# EasyEDA Pro project ProProject_Hi3861_v2.1_2024-07-26.epro, board PCB3
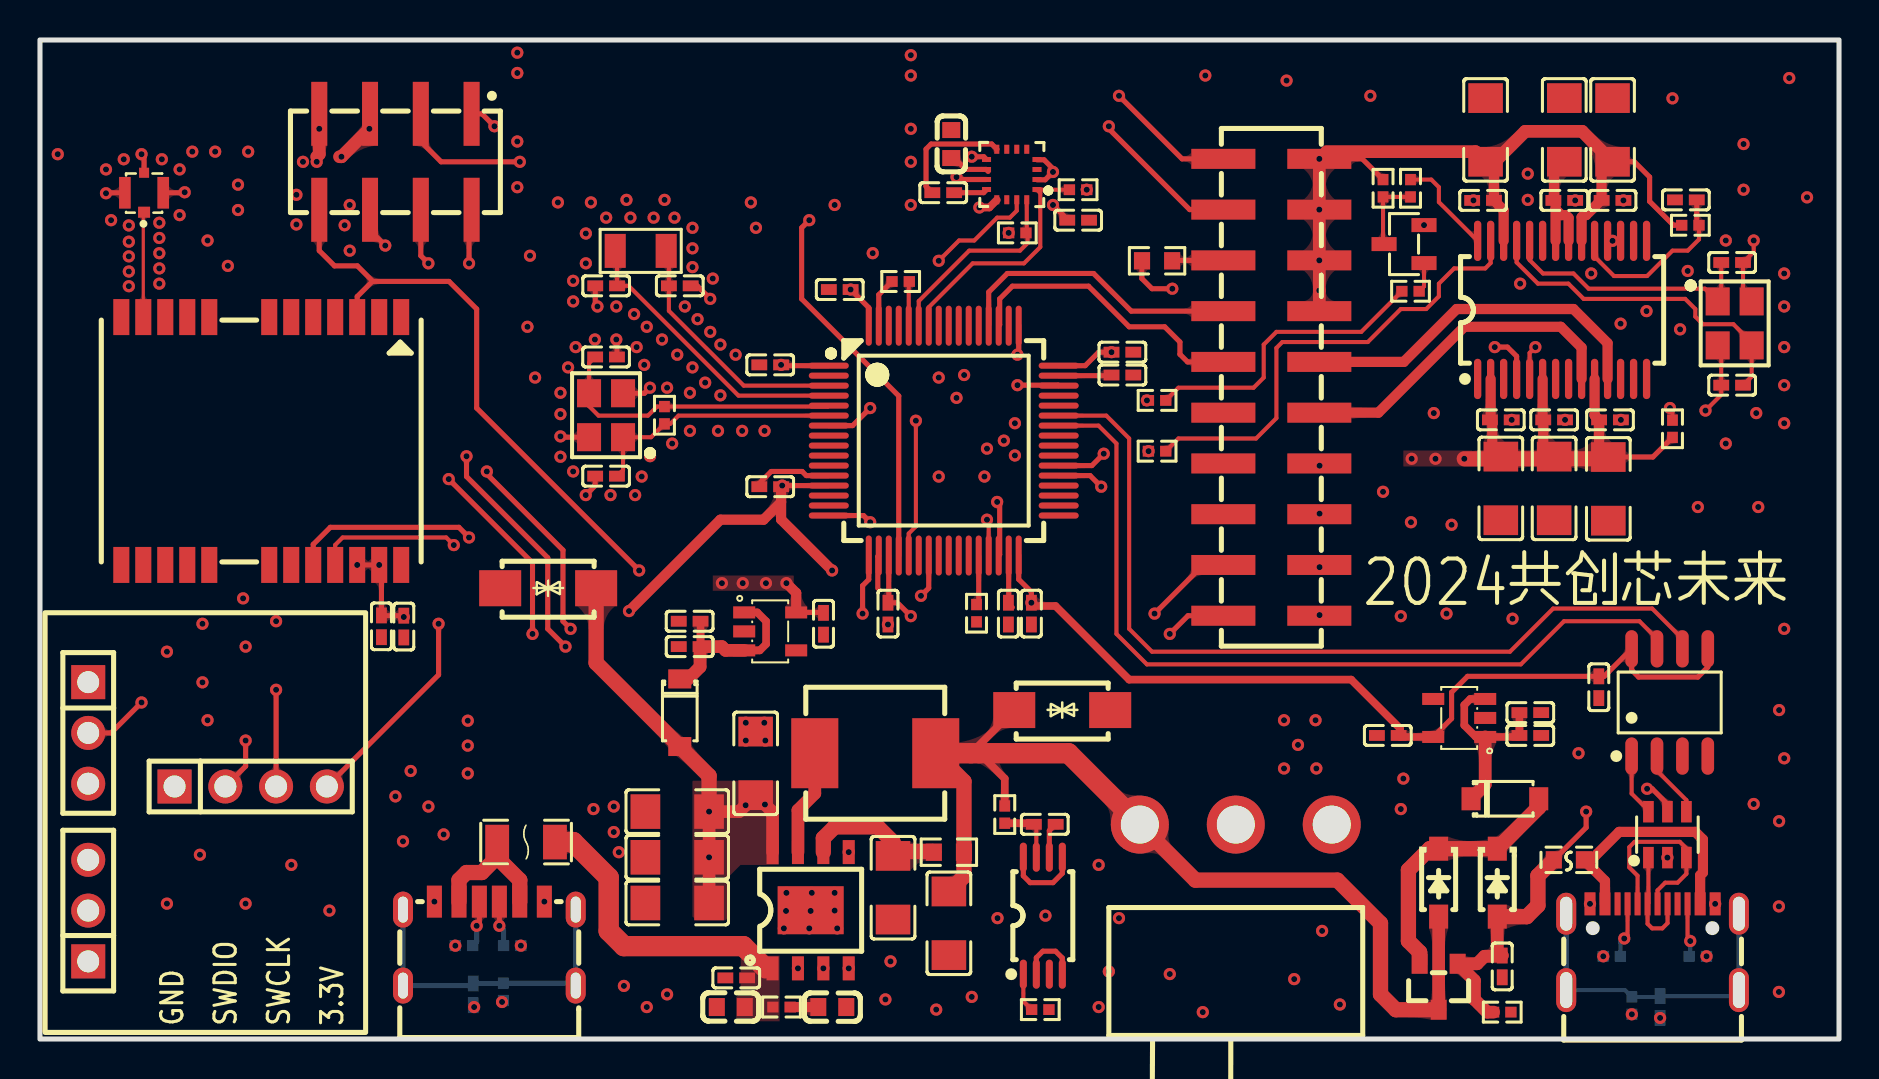
[diagram p8: board, top side]
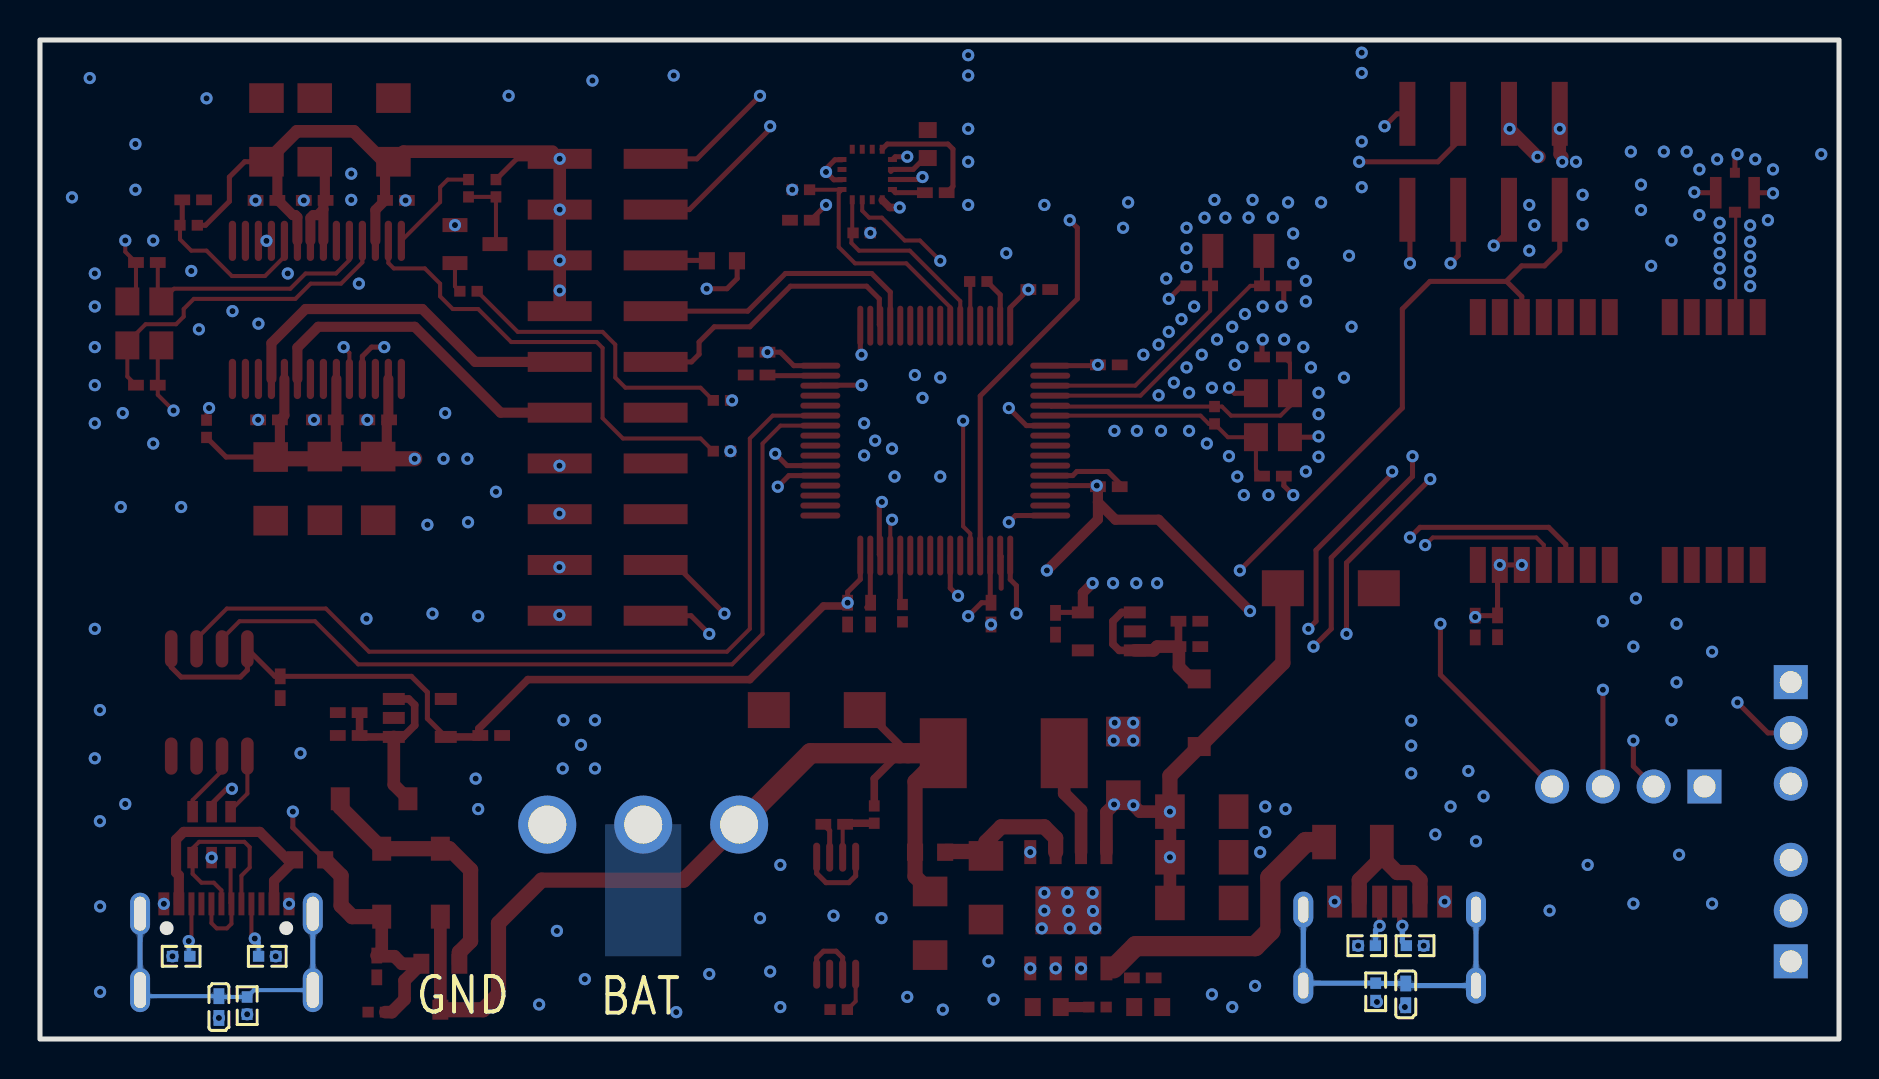
[diagram p9: board, bottom side, seen from below]

Outline 89.99 x 49.99 mm; copper layers: Top Layer, Inner1, Inner2, Bottom Layer. Coordinates in mm from the lower left corner of the outline.
Outline path: rectangle 0,49.99 89.99,0
Stack: Top Layer 0.035mm 外层铜厚1oz / Dielectric1 0.2104mm 7628 RC49% 8.6mil / Inner1 0.0152mm 内层铜厚 / Dielectric2 1.065mm 1.1mm H/HOZ 含铜 / Inner2 0.0152mm 内层铜厚 / Dielectric3 0.2104mm 7628 RC49% 8.6mil / Bottom Layer 0.035mm 外层铜厚1oz

## Design rules (mm)
template: JLCPCB Capability(Two Layers Board)
spacing copperThickness1oz (default): track to track 0.102, other pairs 0.152 to 0.3
spacing copperThickness2oz: track to track 0.203, other pairs 0.152 to 0.3
track width copperThickness1oz (default): min 0.127, default 0.254, max 2.54
track width copperThickness2oz: min 0.203, default 0.254, max 2.54
differential pair differentialPair (default): width min 0.127, default 0.254, max 2.54; gap min 0.152, default 0.152
via viaSize (default): diameter min 0.5, default 0.61, max 10; hole min 0.3, default 0.305, max 6.3

## Placement (name value [footprint] x y rotation side)
C1  100nF  [C0402]  34.83 3.06 0 top
C3  100nF  [C0402]  77.98 17.6 90 top
C5  22uf  [C1206]  42.67 7.57 90 top
C6  22uf  [C1206]  45.47 5.79 90 top
C8  22uf  [C1206]  35.8 13.79 270 top
C9  22uf  [C1206]  31.88 11.38 0 top
C10  22uf  [C1206]  31.88 9.09 0 top
C11  22uf  [C1206]  31.88 6.81 0 top
C12  104p  [C0402]  50.26 10.74 180 top
C13  47nf  [C0402]  73.15 3.63 90 top
C17  10u  [C0402]  74.55 16.33 0 top
C18  100nF  [C0402]  74.55 15.19 0 top
C19  10u  [C0402]  67.42 15.19 180 top
C20  100nF  [C0402]  18.2 20.64 90 top
C21  100nF  [C0402]  17.08 20.65 90 top
C24  10U  [C0603]  39.63 1.6 180 top
C25  10U  [C0603]  34.56 1.6 0 top
C28  100nF  [C0402]  36.53 33.73 0 top
C29  100nF  [C0402]  42.42 21.28 90 top
C32  100nF  [C0402]  49.59 21.28 90 top
C33  100nF  [C0402]  54.15 34.37 180 top
C34  100nF  [C0402]  40 37.5 0 top
C35  100nF  [C0402]  36.53 27.64 0 top
C40  2.2u  [C0402]  54.15 33.22 180 top
C41  2.2u  [C0402]  48.44 21.28 90 top
C42  20p  [C0402]  28.32 28.16 0 top
C43  20p  [C0402]  28.32 34.13 0 top
C44  20p  [C0402]  32 37.69 0 top
C45  20p  [C0402]  28.32 37.69 180 top
C54  100nF  [C0402]  81.04 1.6 90 bottom
C55  10u  [C0402]  32.5 20.9 180 top
C56  100nF  [C0402]  32.5 19.63 180 top
C57  10u  [C0402]  39.19 20.78 270 top
C58  100nF  [C0402]  21.67 2.23 90 bottom
C59  4.7u  [C0603]  45.59 44.78 270 top
C60  220n  [C0402]  45.18 42.35 180 top
C61  100nF  [C0402]  51.93 40.97 180 top
C62  20p  [C0402]  84.65 38.85 180 top
C63  20p  [C0402]  84.65 32.72 180 top
C64  100nF  [C0402]  82.33 41.99 0 top
C65  100nF  [C0402]  76.25 41.96 180 top
C66  100nF  [C0402]  73.07 30.98 180 top
C67  100nF  [C0402]  75.74 30.98 180 top
C68  100nF  [C0402]  78.54 30.98 180 top
C69  100nF  [C0402]  72.19 41.96 0 top
C70  100nF  [C0402]  78.66 41.96 180 top
C71  47uf  [C1206]  76.25 45.49 270 top
C72  47uf  [C1206]  73.07 27.55 90 top
C73  47uf  [C1206]  75.74 27.55 90 top
C74  47uf  [C1206]  78.45 27.53 90 top
C75  47uf  [C1206]  72.31 45.49 270 top
C76  47uf  [C1206]  78.66 45.49 270 top
CN1  PM254-2-10-S-8.5  [HDR-SMD_20P-P2.54-V-F-R2-C10-S2.54-LS7.1]  61.59 32.61 90 top
CN2  PM254-2-04-S-8.5  [HDR-SMD_8P-P2.54-V-F-R2-C4-S7.1]  17.78 43.89 180 top
CRYSTAL1  16MHz  [CRYSTAL-SMD_4P-L3.2-W2.5-BL_SIT8008BI]  28.32 31.21 90 top
CRYSTAL2  16MHz  [CRYSTAL-SMD_4P-L3.2-W2.5-BL_SIT8008BI]  84.77 35.81 270 top
D1  SMAJ15CA  [SMA_L4.3-W2.7-LS5.1-BI]  51.13 16.46 180 top
D2  SMAJ15CA  [SMA_L4.3-W2.7-LS5.1-BI]  25.42 22.56 180 top
D4  DSS24  [SOD-123_L2.8-W1.8-LS3.7-RD]  73.28 12.02 0 top
D5  USBLC6-2SC6  [SOT-23-6_L2.9-W1.6-P0.95-LS2.8-BL]  81.41 10.23 0 top
D6  DSS24  [SOD-123_L2.8-W1.8-LS3.7-RD]  32 16.33 270 top
D7  1N5819HW  [SOD-123_L2.7-W1.6-LS3.7-RD-1]  72.9 7.82 270 top
D8  1N5819HW  [SOD-123_L2.7-W1.6-LS3.7-RD-1]  69.96 7.82 270 top
F1  ASMD0603-020  [F0603]  76.48 8.97 0 top
F3  ASMD1206-025  [F1206]  24.31 9.86 180 top
H2  PZ254V-11-04P  [HDR-TH_4P-P2.54-V-M]  10.54 12.64 0 top
H7  PZ254V-11-03P  [HDR-TH_3P-P2.54-V-M]  2.41 15.32 270 top
H8  PZ254V-11-03P  [HDR-TH_3P-P2.54-V-M]  2.41 6.43 90 top
L1  2.2uH  [IND-SMD_L7.0-W6.6_MCW-0650-220]  41.78 14.3 0 top
Q2  AO3401A  [SOT-23_L2.9-W1.3-P1.90-LS2.4-BR]  69.96 2.62 90 top
Q3  SS8050  [SOT-23-3_L2.9-W1.3-P1.90-LS2.4-BR]  68.23 39.77 0 top
R1  10K  [R0402]  23.62 4.67 180 bottom
R5  10K  [R0402]  78.62 4.14 0 bottom
R6  2  [R0402]  37.09 1.6 180 top
R7  1k  [R0402]  50.04 1.47 180 top
R8  100  [R0402]  48.26 11.23 90 top
R9  0.5  [R0603]  45.47 9.35 0 top
R10  10K  [R0603]  55.88 38.94 180 top
R17  10K  [R0402]  73.15 1.35 180 top
R32  10K  [R0402]  21.21 4.67 180 bottom
R33  10K  [R0402]  23.18 2.36 90 bottom
R35  10K  [R0402]  79.63 1.67 90 bottom
R38  1M  [R0402]  31.24 31.21 90 top
R41  10K  [R0402]  82.93 4.14 180 bottom
R42  10K  [R0402]  43.05 37.9 180 top
R43  10K  [R0402]  46.85 21.31 270 top
R44  100  [R0402]  55.88 31.95 180 top
R45  10K  [R0402]  55.88 29.41 180 top
R46  2.2k  [R0402]  51.93 42.49 0 top
R47  2.2k  [R0402]  48.89 40.34 180 top
R48  10K  [R0402]  81.66 30.53 90 top
R49  1M  [R0402]  82.56 40.72 180 top
R50  1k  [R0402]  68.56 37.41 180 top
R51  510  [R0402]  68.56 42.57 270 top
R52  1k  [R0402]  67.18 42.57 270 top
U1  IP5306  [ESOP-8_L4.9-W3.9-P1.27-LS6.0-BL-EP]  38.55 6.44 0 top
U2  DW03D  [TSSOP-8_L4.4-W3.0-P0.65-LS6.4-BL]  50.16 6.17 0 top
U3  ATGM332D-5N31  [GSM-SMD_ATGM332D-5N31]  11.07 29.92 90 top
U5  CH340N  [SOP-8_L4.9-W3.9-P1.27-LS6.0-BL]  81.52 16.84 0 top
U8  STM32F405RGT6  [LQFP-64_L10.0-W10.0-P0.50-LS12.0-BL]  45.21 29.94 270 top
U10  ME6217C33M5G  [SOT-23-5_L3.0-W1.7-P0.95-LS2.8-BR]  36.53 20.4 180 top
U16  ME6217C33M5G  [SOT-23-5_L3.0-W1.7-P0.95-LS2.8-BR]  70.99 16.06 0 top
U17  IPEX4  [IPEX-SMD_4P-L1.8-W1.7-LS2.0-1]  5.21 42.36 0 top
U23  SS12D06弯针  [SW-TH_3P-SS12D06-1]  59.82 10.73 0 top
U24  QMC5883L  [LGA-16_L3.0-W3.0-P0.50-BL_SQ]  48.61 43.26 90 top
U25  SYN6288  [SSOP-28_L10.2-W5.3-P0.65-LS7.8-BL]  76.14 36.48 0 top
USB4  USB_32  [USB-SMD_TYPEC-16PIN]  80.66 4.61 0 top
USB5  TYPEC-250D-BCP6  [USB-C-SMD_TYPEC-250D-BCP6]  22.48 4.78 0 top
X1  32.768kHz  [CRYSTAL-SMD_L3.2-W1.5-1]  30.05 39.43 0 top

## Footprints (pads in the part's own frame, mm; a bottom-side part is the same pattern mirrored in y, then rotated)
C0402
  rect 0.79x0.54 smd: 1(-0.545,0) 2(0.545,0)
C0603
  rect 0.8x0.9 smd: 1(-0.7,0) 2(0.7,0)
C1206
  rect 1.485x1.728 smd: 1(-1.593,0) 2(1.593,0)
CRYSTAL-SMD_4P-L3.2-W2.5-BL_SIT8008BI
  rect 1.4x1.2 smd: 1(-1.1,-0.85) 2(1.1,-0.85) 3(1.1,0.85) 4(-1.1,0.85)
CRYSTAL-SMD_L3.2-W1.5-1
  rect 1.05x1.7 smd: 1(-1.275,0) 2(1.275,0)
ESOP-8_L4.9-W3.9-P1.27-LS6.0-BL-EP
  rect 0.6x1.2 smd: 1(-1.905,-2.909) 2(-0.635,-2.909) 3(0.635,-2.909) 4(1.905,-2.909) 5(1.905,2.909) 6(0.635,2.909) 7(-0.635,2.909) 8(-1.905,2.909)
  rect 3.3x2.4 smd: 9(0,0)
F0603
  rect 0.806x0.864 smd: 1(-0.753,0) 2(0.753,0)
F1206
  rect 1.19x1.728 smd: 1(-1.445,0) 2(1.445,0)
GSM-SMD_ATGM332D-5N31
  rect 1.8x0.8 smd: 1(6.2,-7) 2(6.2,-5.9) 3(6.2,-4.8) 4(6.2,-3.7) 5(6.2,-2.6) 6(6.2,-1.5) 7(6.2,-0.4) 8(6.2,2.6) 9(6.2,3.7) 10(6.2,4.8) 11(6.2,5.9) 12(6.2,7) 13(-6.2,7) 14(-6.2,5.9) 15(-6.2,4.8) 16(-6.2,3.7) 17(-6.2,2.6) 18(-6.2,-0.4) 19(-6.2,-1.5) 20(-6.2,-2.6) 21(-6.2,-3.7) 22(-6.2,-4.8) 23(-6.2,-5.9) 24(-6.2,-7)
HDR-SMD_8P-P2.54-V-F-R2-C4-S7.1
  rect 0.8x3.2 smd: 1(-3.81,-2.4) 2(-3.81,2.4) 3(-1.27,-2.4) 4(-1.27,2.4) 5(1.27,-2.4) 6(1.27,2.4) 7(3.81,-2.4) 8(3.81,2.4)
HDR-SMD_20P-P2.54-V-F-R2-C10-S2.54-LS7.1
  rect 1x3.2 smd: 1(-11.43,-2.4) 2(-11.43,2.4) 3(-8.89,-2.4) 4(-8.89,2.4) 5(-6.35,-2.4) 6(-6.35,2.4) 7(-3.81,-2.4) 8(-3.81,2.4) 9(-1.27,-2.4) 10(-1.27,2.4) 11(1.27,-2.4) 12(1.27,2.4) 13(3.81,-2.4) 14(3.81,2.4) 15(6.35,-2.4) 16(6.35,2.4) 17(8.89,-2.4) 18(8.89,2.4) 19(11.43,-2.4) 20(11.43,2.4)
HDR-TH_3P-P2.54-V-M
  rect 1.7x1.7 hole 1.1: 1(-2.54,0)
  round 1.7 hole 1.1: 2(0,0) 3(2.54,0)
HDR-TH_4P-P2.54-V-M
  rect 1.7x1.7 hole 1.1: 1(-3.81,0)
  round 1.7 hole 1.1: 2(-1.27,0) 3(1.27,0) 4(3.81,0)
IND-SMD_L7.0-W6.6_MCW-0650-220
  rect 2.35x3.5 smd: 1(-3.025,0) 2(3.025,0)
IPEX-SMD_4P-L1.8-W1.7-LS2.0-1
  rect 0.6x0.55 smd: 1(0.001,-0.988)
  rect 0.58x1.58 smd: 2(0.96,-0.013) 4(-0.96,-0.013)
  rect 0.5x0.5 smd: 3(0.001,0.988)
LGA-16_L3.0-W3.0-P0.50-BL_SQ
  rect 0.25x0.45 smd: 1(-0.75,-1.263) 2(-0.25,-1.263) 3(0.25,-1.263) 4(0.75,-1.263) 9(0.75,1.263) 10(0.25,1.263) 11(-0.25,1.263) 12(-0.75,1.263)
  rect 0.45x0.25 smd: 5(1.263,-0.75) 6(1.263,-0.25) 7(1.263,0.25) 8(1.263,0.75) 13(-1.263,0.75) 14(-1.263,0.25) 15(-1.263,-0.25) 16(-1.263,-0.75)
LQFP-64_L10.0-W10.0-P0.50-LS12.0-BL
  oval 0.3x2 smd: 1(-3.75,-5.75) 2(-3.25,-5.75) 3(-2.75,-5.75) 4(-2.25,-5.75) 5(-1.75,-5.75) 6(-1.25,-5.75) 7(-0.75,-5.75) 8(-0.25,-5.75) 9(0.25,-5.75) 10(0.75,-5.75) 11(1.25,-5.75) 12(1.75,-5.75) 13(2.25,-5.75) 14(2.75,-5.75) 15(3.25,-5.75) 16(3.75,-5.75) 33(3.75,5.75) 34(3.25,5.75) 35(2.75,5.75) 36(2.25,5.75) 37(1.75,5.75) 38(1.25,5.75) 39(0.75,5.75) 40(0.25,5.75) 41(-0.25,5.75) 42(-0.75,5.75) 43(-1.25,5.75) 44(-1.75,5.75) 45(-2.25,5.75) 46(-2.75,5.75) 47(-3.25,5.75) 48(-3.75,5.75)
  oval 2x0.3 smd: 17(5.75,-3.75) 18(5.75,-3.25) 19(5.75,-2.75) 20(5.75,-2.25) 21(5.75,-1.75) 22(5.75,-1.25) 23(5.75,-0.75) 24(5.75,-0.25) 25(5.75,0.25) 26(5.75,0.75) 27(5.75,1.25) 28(5.75,1.75) 29(5.75,2.25) 30(5.75,2.75) 31(5.75,3.25) 32(5.75,3.75) 49(-5.75,3.75) 50(-5.75,3.25) 51(-5.75,2.75) 52(-5.75,2.25) 53(-5.75,1.75) 54(-5.75,1.25) 55(-5.75,0.75) 56(-5.75,0.25) 57(-5.75,-0.25) 58(-5.75,-0.75) 59(-5.75,-1.25) 60(-5.75,-1.75) 61(-5.75,-2.25) 62(-5.75,-2.75) 63(-5.75,-3.25) 64(-5.75,-3.75)
R0402
  rect 0.566x0.54 smd: 1(-0.433,0) 2(0.433,0)
R0603
  rect 0.806x0.864 smd: 1(-0.753,0) 2(0.753,0)
SMA_L4.3-W2.7-LS5.1-BI
  rect 2.1x1.8 smd: 1(-2.4,0) 2(2.4,0)
SOD-123_L2.7-W1.6-LS3.7-RD-1
  rect 1.2x0.95 smd: 1(-1.7,0) 2(1.7,0)
SOD-123_L2.8-W1.8-LS3.7-RD
  rect 0.95x1.15 smd: 1(-1.692,0) 2(1.692,0)
SOP-8_L4.9-W3.9-P1.27-LS6.0-BL
  oval 0.63x1.865 smd: 1(-1.905,-2.683) 2(-0.635,-2.683) 3(0.635,-2.683) 4(1.905,-2.683) 5(1.905,2.683) 6(0.635,2.683) 7(-0.635,2.683) 8(-1.905,2.683)
SOT-23-3_L2.9-W1.3-P1.90-LS2.4-BR
  rect 1.25x0.7 smd: 1(1,-0.95) 2(1,0.95) 3(-1,0)
SOT-23-5_L3.0-W1.7-P0.95-LS2.8-BR
  rect 1.1x0.6 smd: 1(1.3,-0.95) 2(1.3,0) 3(1.3,0.95) 4(-1.3,0.95) 5(-1.3,-0.95)
SOT-23-6_L2.9-W1.6-P0.95-LS2.8-BL
  rect 0.532x1.072 smd: 1(-0.95,-1.149) 2(0,-1.149) 3(0.95,-1.149) 4(0.95,1.149) 5(0,1.149) 6(-0.95,1.149)
SOT-23_L2.9-W1.3-P1.90-LS2.4-BR
  rect 1x0.8 smd: 1(1.15,-0.95) 2(1.15,0.95) 3(-1.15,0)
SSOP-28_L10.2-W5.3-P0.65-LS7.8-BL
  oval 0.364x2.015 smd: 1(-4.225,-3.455) 2(-3.575,-3.455) 3(-2.925,-3.455) 4(-2.275,-3.455) 5(-1.625,-3.455) 6(-0.975,-3.455) 7(-0.325,-3.455) 8(0.325,-3.455) 9(0.975,-3.455) 10(1.625,-3.455) 11(2.275,-3.455) 12(2.925,-3.455) 13(3.575,-3.455) 14(4.225,-3.455) 15(4.225,3.455) 16(3.575,3.455) 17(2.925,3.455) 18(2.275,3.455) 19(1.625,3.455) 20(0.975,3.455) 21(0.325,3.455) 22(-0.325,3.455) 23(-0.975,3.455) 24(-1.625,3.455) 25(-2.275,3.455) 26(-2.925,3.455) 27(-3.575,3.455) 28(-4.225,3.455)
SW-TH_3P-SS12D06-1
  round 2.9 hole 1.9: 1(-4.8,0) 2(0,0) 3(4.8,0)
TSSOP-8_L4.4-W3.0-P0.65-LS6.4-BL
  oval 0.353x1.454 smd: 1(-0.975,-2.927) 2(-0.325,-2.927) 3(0.325,-2.927) 4(0.975,-2.927) 5(0.975,2.927) 6(0.325,2.927) 7(-0.325,2.927) 8(-0.975,2.927)
USB-C-SMD_TYPEC-250D-BCP6
  oval 1x1.8 hole 0.5x1.3: 1(-4.32,1.7) 2(-4.32,-2.1) 3(4.32,-2.1) 4(4.32,1.7)
  rect 0.75x1.6 smd: A5(-0.5,2.1) A9(1.52,2.1) A12(2.75,2.1) B5(0.5,2.1) B9(-1.52,2.1) B12(-2.75,2.1)
USB-SMD_TYPEC-16PIN
  oval 1x2.1 hole 0.6x1.7: 12(-4.32,1.663) 13(4.32,1.663)
  oval 1x2.2 hole 0.6x1.8: 14(-4.32,-2.158) 15(4.32,-2.158)
  rect 0.55x1.15 smd: A1B12(-3.13,2.158) A4B9(-2.38,2.158) B1A12(3.131,2.158) B4A9(2.38,2.158)
  rect 0.3x1.15 smd: A5(-1.25,2.158) A6(-0.25,2.158) A7(0.25,2.158) A8(1.25,2.158) B5(1.75,2.158) B6(0.75,2.158) B7(-0.75,2.158) B8(-1.75,2.158)

## Nets
As in the schematic.

Pads without a net: CN1 10; H8 1 2 3; U3 1 2 4 5 6 7 8 9 14 15 16 17 18 19; U5 4; U8 2 8 9 10 11 14 15 22 24 25 26 27 33 34 35 36 39 40 41 44 45 50 53 54 55 56 57 61 62; U10 4; U16 4; U23 3; U24 3 5 6 7 14; U25 13 14 15; USB4 A8 B8

## Via types
v1: diameter 0.61, hole 0.305, Top Layer to Bottom Layer, 332 vias

## Routing (per net, layer and track width the routed paths; a pad name or vN(x,y) marks a point on that pad's centre or on a via; arc(x,y) is an arc through that point)
3.3V: length 79.9
  Top Layer w0.254: C20.2 17.09,21.18 C21.2 17.08,23.61 v1(16.97,23.72) v1(15.87,23.72) ; C57.1 39.17,21.35 U10.5 ; 49.87,42.99 50.28,42.99 v1(50.67,43.38) 50.67,43.55 50.23,43.99 49.87,43.99 ; C61.2 51.39,41.02 v1(50.67,41.73)
  Top Layer w0.381: 47.86,41.98 47.49,41.61 v1(46.99,41.61)
  Top Layer w0.508: v1(37.34,22.81) 37.83,22.32 U10.5
  Inner2 w0.254: v1(50.67,43.38) v1(50.67,41.73) 50.55,41.61 v1(46.99,41.61) ; v1(52.36,42.49) 52.32,42.46 52.32,41.61 51.05,40.34 v1(48.46,40.34) 46.35,40.34 46.23,40.46
  Inner2 w0.635: v1(18.2,21.12) 16.97,22.35 v1(16.97,23.72) 19.48,26.24 30.86,26.24 34.29,22.81 v1(35.15,22.81) v1(36.31,22.81) v1(37.34,22.81) 42.67,28.14 42.67,32.97 39.37,36.27 39.37,39.32 40.39,40.34 40.39,40.46 46.23,40.46 46.99,41.22 v1(46.99,41.61)
  vias: v1(34.11,22.81)
3.3V_32: length 139.4
  Top Layer w0.254: U8.13 v1(37.13,27.69) C35.2 ; 50.96,33.69 52.28,33.69 52.96,34.37 v1(53.6,34.37) ; H2.4 19.94,18.22 v1(19.94,20.78) ; v1(37.07,33.73) 37.11,33.69 U8.1 ; U8.19 42.46,21.87 C29.2 42.89,21.83 v1(43.56,21.16) ; U16.5 70.61,16.03 70.61,17.35 71.41,18.15 C3.2 78.24,18.15 U5.8 79.62,18.46 79.97,18.11 82.93,18.11 83.43,18.61 U5.5 ; v1(40.55,37.5) 41.46,36.59 U8.64 ; U8.32 48.96,23 49.59,22.37 v1(49.59,21.83)
  Top Layer w0.381: v1(49.59,21.83) 49.76,21.67 50.8,21.67 54.48,17.98 65.59,17.98 68.04,15.53 68.04,15.12 ; 68.04,15.12 C19.1 ; 68.04,15.12 U16.5
  Top Layer w0.508: 37.07,26.86 C35.2 ; 37.07,26.86 37.07,26 v1(39.62,23.44) ; 37.07,26.86 36.19,25.98 34.04,25.98 v1(29.46,21.41)
  Inner1 w0.254: v1(19.94,20.78) 20.57,21.41 v1(29.46,21.41)
  Inner2 w0.508: v1(39.62,23.44) 41.28,23.44 v1(43.56,21.16) 44.07,21.16 44.74,21.83 v1(49.59,21.83) 51.18,23.42 51.18,29.16 53.6,31.58 v1(53.6,34.37) 50.47,37.5 v1(40.55,37.5) ; v1(37.13,27.69) 37.13,33.67 v1(37.07,33.73)
5V: length 151.5
  Top Layer w0.254: C74.2 80.68,29.12 R48.1 ; R49.2 81.71,40.72 80.52,41.91 80.52,43.13 79.75,43.89 C76.2 ; v1(64,44.04) 66.14,44.04 R52.1
  Top Layer w0.508: U25.26 73.22,41.48 C69.2 72.73,43.48 C75.2 72.17,44.04 ; U25.2 72.57,31.01 C66.2 72.64,30.86 72.64,29.57 C72.2 ; C73.2 75.2,29.69 C67.2 75.17,31.01 U25.6 ; U25.20 77.12,41.12 77.22,41.22 77.34,41.22 78.08,41.96 C70.2 78.12,43.35 C76.2 ; C74.2 77.99,29.58 C68.2 77.77,31.2 U25.10
  Top Layer w0.635: 36.65,9.35 36.65,11.35 v1(36.26,11.74) C8.2 v1(35.3,11.7) 34.98,11.38 v1(33.47,11.38) v1(33.47,9.09) C11.2 ; C76.2 77.14,45.42 74.29,45.42 72.92,44.04 72.17,44.04 71.81,44.4 64.35,44.4 ; 64,36.42 v1(64,37.45) v1(64,38.96) v1(64,41.5) v1(64,44.04) ; 78.36,29.03 C74.2
  Top Layer w0.762: D2.1 27.82,18.82 D6.2 33.47,13.17 v1(33.47,11.38) ; v1(71.25,29.03) 78.36,29.03
  Inner2 w0.762: v1(36.26,11.74) 35.91,11.38 v1(33.47,11.38) ; v1(64,37.45) 64,33.24 68.2,29.03 v1(68.62,29.03) v1(69.81,29.03) v1(71.25,29.03)
  Inner2 w0.889: 64,33.24 63.51,33.24 61.21,30.94 61.21,21.54 58.17,18.49 39.5,18.49 37.97,16.97 37.97,13.45 v1(36.26,11.74) ; v1(33.47,9.09) v1(33.47,11.38)
GND: length 33.2
  Top Layer w0.203: v1(85.72,39.95) 85.72,39.39 C62.1 85.19,37.34 CRYSTAL2.4 ; CRYSTAL2.2 84.1,34.53 C63.2 84.1,32.23 v1(83.31,31.45)
  Top Layer w0.254: C42.1 27.77,27.69 v1(27.3,27.22) ; R42.2 41.96,37.24 U8.63 ; U8.18 41.91,24.14 41.91,22.56 ; v1(45.85,43.13) 45.97,43.01 U24.11 ; v1(26.03,30.15) 26.08,30.11 CRYSTAL1.4 ; U8.12 38.33,28.19 38.12,28.4 36.58,28.4 35.98,27.8 C35.1 ; U24.9 47.21,44.14 v1(46.61,44.14) ; U17.3 5.21,44.14 v1(5.08,44.27) ; CRYSTAL1.2 30.24,32.31 v1(30.51,32.59) ; v1(33.53,37.03) 32.88,37.69 C44.2 ; U17.4 3.33,42.34 v1(3.3,42.32) ; v1(7.24,42.37) 7.22,42.34 6.17,42.34 ; v1(27.89,36.65) 27.78,36.76 C45.2 ; C12.1 50.49,10.43 U2.6 ; C43.2 28.86,34.97 v1(28.83,35)
  Top Layer w0.635: v1(16.48,45.54) v1(15.08,44.14) 14.99,44.14 ; 13.84,44.14 13.97,44.27 v1(13.97,45.54)
  vias: v1(0.89,44.27) v1(3.3,43.51) v1(3.56,40.97) v1(4.19,44.02) v1(4.44,40.71) v1(4.44,39.89) v1(4.44,39.16) v1(4.44,38.4) v1(4.44,37.67) v1(5.97,40.84) v1(5.97,40.08) v1(5.97,39.32) v1(5.97,38.56) v1(5.97,37.79) v1(6.1,44.02) v1(6.35,19.38) v1(6.35,6.77) v1(6.98,43.51) v1(6.98,41.22) v1(7.62,44.4) v1(8,9.22) v1(8.13,20.78) v1(8.13,17.85) v1(8.38,39.95) v1(8.38,15.95) v1(8.76,44.4) v1(9.4,38.68) v1(9.91,42.75) v1(9.91,41.48) v1(10.16,22.05) v1(10.29,19.63) v1(10.29,6.77) v1(10.41,44.4) v1(11.81,20.9) v1(12.57,8.71) v1(12.83,42.24) v1(12.83,40.76) v1(13.16,43.89) v1(13.84,43.89) v1(14.48,6.43) v1(15.24,40.72) v1(15.49,41.73) v1(15.49,39.45) v1(17.78,12.14) v1(18.16,9.89) v1(18.54,13.41) v1(19.43,11.63) v1(19.73,6.88) v1(20.19,10.24) v1(20.78,4.67) v1(21.4,15.93) v1(21.4,14.68) v1(21.4,13.29) v1(21.72,1.6) v1(23.11,1.85) v1(23.88,49.35) v1(23.88,48.34) v1(23.88,44.91) v1(23.88,42.62) v1(24.06,4.67) v1(24.38,35.64) v1(24.51,39.19) v1(24.77,33.1) v1(25.23,6.88) v1(25.91,41.86) v1(26.03,32.33) v1(26.03,31.27) v1(26.03,29.13) v1(26.42,33.6) v1(26.67,37.94) v1(26.67,36.91) v1(26.67,28.4) v1(26.8,34.62) v1(27.31,40.3) v1(27.31,38.81) v1(27.56,41.86) v1(27.69,11.51) v1(27.76,35) v1(28.32,41.1) v1(28.54,27.22) v1(28.7,11.63) v1(28.7,10.36) v1(28.83,36.65) v1(28.96,9.35) v1(29.21,2.66) v1(29.34,41.99) v1(29.54,41.1) v1(29.72,36.27) v1(29.84,34.62) v1(29.77,27.22) v1(30.1,28.14) v1(30.23,33.73) v1(30.35,35.64) v1(30.35,1.6) v1(30.52,29.16) v1(30.7,41.1) v1(31.12,35) v1(31.24,41.99) v1(31.37,32.59) v1(31.37,2.23) v1(31.62,29.79) v1(31.74,41.1) v1(31.88,34.24) v1(32.26,36.65) v1(32.51,32.33) v1(32.51,30.43) v1(32.64,40.59) v1(32.64,39.56) v1(32.64,38.62) v1(32.64,33.6) v1(32.89,36.02) v1(33.27,32.84) v1(33.53,35.38) v1(33.66,38.05) v1(33.92,30.43) v1(34.04,34.75) v1(34.04,32.21) v1(34.8,34.24) v1(35.12,30.43) v1(35.31,15.82) v1(35.31,14.94) v1(35.56,41.86) v1(35.81,40.59) v1(36.25,30.43) v1(36.23,15.82) v1(36.28,14.94) v1(37.21,5.54) v1(37.34,7.31) v1(37.32,6.41) v1(38.48,5.54) v1(38.61,7.31) v1(38.55,6.41) v1(39.75,41.73) v1(39.75,7.31) v1(39.75,6.43) v1(39.88,5.54) v1(41.66,39.32) v1(42.29,1.98) v1(42.42,20.74) v1(42.54,3.89) v1(43.56,49.23) v1(43.56,48.21) v1(43.56,45.54) v1(43.56,43.89) v1(43.56,41.73) v1(44.83,1.47) v1(44.96,33.1) v1(44.96,28.14) v1(45.85,32.08) v1(46.23,33.22) v1(46.61,2.11) v1(47.24,28.14) v1(47.37,29.54) v1(47.9,6.05) v1(48.22,29.94) v1(48.77,30.81) v1(48.77,29.2) v1(50.3,6.17) v1(52.96,8.71) v1(52.96,1.6) v1(53.47,3.38) v1(53.97,6.05) v1(56.51,3.25) v1(58.17,1.35) v1(58.29,48.21) v1(62.23,15.95) v1(62.23,13.54) v1(62.36,47.95) v1(62.74,3) v1(62.93,14.72) v1(63.81,15.95) v1(63.85,13.54) v1(64.13,5.41) v1(65.02,1.73) v1(66.55,47.19) v1(67.18,27.38) v1(68.07,21.16) v1(68.07,11.51) v1(68.2,13.03) v1(68.58,25.86) v1(69.23,40.72) v1(69.72,31.32) v1(70.36,21.28) v1(70.61,25.73) v1(71.71,41.96) v1(73.62,30.98) v1(73.66,21.03) v1(74.04,37.8) v1(74.42,43.3) v1(74.42,41.99) v1(76.29,30.98) v1(76.79,41.96) v1(76.96,14.3) v1(77.54,6.76) v1(77.6,38.3) v1(78.2,4.14) v1(78.66,39.94) v1(79.07,35.79) v1(79.08,30.98) v1(79.21,41.96) v1(79.63,1.24) v1(80.36,36.42) v1(81.04,1.06) v1(81.41,9.08) v1(81.66,47.07) v1(82.04,35.51) v1(82.42,38.43) v1(82.93,26.62) v1(83.36,4.14) v1(83.8,6.76) v1(84.33,39.95) v1(84.33,29.79) v1(85.22,44.78) v1(85.22,42.49) v1(85.72,11.76) v1(85.85,31.32) v1(85.95,26.62) v1(87,16.46) v1(87,10.9) v1(86.99,6.64) v1(86.99,2.36) v1(87.25,38.3) v1(87.25,36.65) v1(87.25,34.62) v1(87.25,32.72) v1(87.25,30.81) v1(87.25,20.52) v1(87.25,14.05) v1(87.5,48.08) v1(88.39,42.11)
VBUS_32: length 21
  Top Layer w0.254: v1(77.34,11.38) 77.34,10.58 F1.1 ; D5.5 81.41,11.76 80.65,12.52 v1(80.39,12.52)
  Top Layer w0.635: R17.2 72.39,1.35 71.75,1.98 71.75,2.93 Q2.1 71.89,3.77 72.26,4.14 73.11,4.14 C13.2 72.9,4.42 D7.2
  Top Layer w0.762: D7.2 74.37,6.12 74.93,6.68 74.93,8.17 F1.1
  Inner1 w0.254: v1(77.34,11.38) 78.49,12.52 v1(80.39,12.52)
VBUS_BAT: length 14.7
  Top Layer w1.016: 36.29,3.54 35.18,4.65 29.21,4.65 28.45,5.41 28.45,8.08 26.67,9.86 F3.1
1PPS: length 46.5
  Top Layer w0.254: U3.3 15.87,37.15 16.63,37.91 16.65,37.91 ; 16.65,37.91 15.88,38.68 14.73,38.68 13.97,39.45 CN2.8 ; 16.65,37.91 20.46,37.91 21.84,36.53 21.84,31.57 v1(29.97,23.44) ; U8.23 44.46,22.56 v1(44.07,22.17)
  Inner1 w0.254: v1(44.07,22.17) 31.24,22.17 v1(29.97,23.44)
8266_BUSY: length 77.4
  Top Layer w0.254: 21.59,46.29 22.11,46.29 v1(22.73,45.67) ; U8.20 42.96,32.18 38.1,37.03 38.1,40.59 v1(38.48,40.97) ; U25.4 73.87,34.16 73.41,34.62 v1(72.77,34.62)
  Inner1 w0.254: v1(72.77,34.62) 65.28,34.62 58.93,40.97 v1(38.48,40.97) 33.78,45.67 v1(22.73,45.67)
8266_CVDD: length 6.2
  Top Layer w0.508: 75.82,41.51 75.82,41.85 C65.2 75.74,42 75.74,43.39 C71.2 ; 75.82,41.51 76.1,41.22 76.33,41.22 76.47,41.09 U25.21 ; 75.82,41.51 U25.22
8266_N: length 18
  Top Layer w0.508: CN1.11 68.22,33.88 70.87,36.53 76.71,36.53 78.42,34.82 U25.11
8266_P: length 16.9
  Top Layer w0.508: U25.9 77.12,34.59 76.07,35.64 71.25,35.64 66.95,31.34 64,31.34
ATGM_RX: length 37.5
  Top Layer w0.203: U8.29 47.46,25.9 v1(47.37,25.98) ; U3.21 14.77,24.72 15.14,25.09 20.32,25.09 v1(20.7,24.71)
  Inner1 w0.203: v1(47.37,25.98) 46.56,26.8 40.31,26.8 37.59,24.08 21.34,24.08 v1(20.7,24.71)
ATGM_TX: length 39.9
  Top Layer w0.254: U8.30 48.01,24.24 48.01,26.75 v1(47.88,26.87) ; U3.20 13.67,24.75 14.52,25.6 20.95,25.6 v1(21.46,25.09)
  Inner1 w0.254: v1(47.88,26.87) 47.5,27.25 39.88,27.25 37.34,24.71 21.84,24.71 v1(21.46,25.09)
BAT+: length 73.1
  Top Layer w0.381: 46.58,14.3 48.74,16.46 ; 48.26,11.74 48.26,13.03 46.99,14.3
  Top Layer w0.635: Q2.3 D8.2
  Top Layer w0.762: C6.2 46.22,8.14 R9.2 46.22,12.89 L1.2 ; Q2.3 67.82,1.47 67.06,2.23 67.06,5.79 64.9,7.95 57.8,7.95 U23.1
  Top Layer w1.016: U23.1 51.45,14.3 L1.2
  Inner2 w1.016: U23.1 64.01,19.72 v1(64.01,21.21) v1(64.01,23.61) v1(64.01,26.29) 64.01,28.91
  vias: v1(64.01,28.69)
DRDY: length 20.8
  Top Layer w0.203: 48.86,41.98 48.86,41.44 48.51,41.1 47.88,41.1 46.74,39.95 45.97,39.95 v1(44.96,38.94) ; v1(43.81,30.94) 43.81,25.65 43.46,25.29 U8.21
  Inner1 w0.203: v1(44.96,38.94) 43.87,37.85 43.87,30.99 v1(43.81,30.94)
IP5306_KEY: length 2.6
  Top Layer w0.254: R10.1 56.65,38.96 CN1.16
LED1: length 46.7
  Top Layer w0.254: v1(26.54,20.52) 26.16,20.9 26.16,24.46 22.35,28.27 v1(22.35,28.4) ; CN2.2 21.46,41.36 v1(21.46,38.81)
  Inner1 w0.254: v1(26.54,20.52) 29.97,17.09 29.97,15.06 31.62,13.41 31.62,6.55 32.77,5.41 36.04,5.41 v1(37.92,3.54) ; v1(22.35,28.4) 22.35,37.92 v1(21.46,38.81)
LED2: length 50
  Top Layer w0.254: CN2.4 19.05,39.19 v1(19.43,38.81) ; v1(26.29,19.63) 25.4,20.52 25.4,24.08 21.34,28.14 v1(21.34,29.16)
  Inner1 w0.254: v1(39.19,3.54) 38.52,2.87 37.72,2.87 35.81,4.78 32.51,4.78 30.73,6.55 30.73,13.16 29.21,14.68 29.21,16.71 v1(26.29,19.63) ; v1(21.34,29.16) 21.34,36.91 v1(19.43,38.81)
LED3: length 53.5
  Top Layer w0.254: v1(20.45,28.02) 24.64,23.83 v1(24.64,20.27) ; v1(17.27,39.7) 16.51,40.46 CN2.6
  Inner1 w0.254: v1(24.64,20.27) 28.32,16.59 28.32,14.43 29.97,12.78 29.97,6.17 32,4.14 35.31,4.14 37.21,2.23 39.15,2.23 v1(40.46,3.54) ; v1(20.45,28.02) 20.45,36.53 v1(17.27,39.7)
MCU_RX/03_TX: length 14.6
  Top Layer w0.254: U8.52 47.46,37.37 48.39,38.3 52.71,38.3 54.59,36.42 59.19,36.42
MCU_TX/03_RX: length 14.7
  Top Layer w0.254: CN1.12 57.4,33.88 57.02,34.26 57.02,34.87 56.26,35.64 54.48,35.64 52.45,37.67 48.64,37.67 48.01,37.03 48.01,35.74 U8.51
NRST: length 33.1
  Top Layer w0.254: 19.05,46.29 19.05,44.91 20.07,43.89 v1(24,43.89) ; v1(41.53,31.57) 40.65,30.69 U8.7
  Inner1 w0.254: v1(41.53,31.57) 41.53,33.73 31.37,43.89 v1(24,43.89)
RST: length 9.2
  Top Layer w0.203: U25.19 77.77,39.14 78.73,38.18 80.39,38.18 81.66,39.45 82.42,39.45 82.99,40.01 R49.1
  Top Layer w0.254: C64.2 82.88,40.83 R49.1
SCL_COMPASS: length 12.3
  Top Layer w0.203: U8.58 44.46,36.61 46.66,38.81 49.22,38.81 50.04,39.63 50.04,42.33 49.87,42.49 49.88,42.49 R46.1
SDA_COMPASS: length 10
  Top Layer w0.203: U8.59 43.96,36.92 46.48,39.45 49.02,39.45 49.4,39.83 49.4,40.25 49.36,40.29 49.36,41.98
SETC: length 1.7
  Top Layer w0.254: 47.35,42.49 47.2,42.35 C60.1
SWCLK: length 51.4
  Top Layer w0.254: v1(48.9,34.24) 48.96,34.3 U8.49 ; v1(11.81,17.48) H2.3
  Inner1 w0.254: v1(11.81,17.48) 11.94,17.48 18.8,24.33 18.8,25.48 19.81,26.49 33.78,26.49 37.47,30.17 45.47,30.17 48.01,32.72 48.01,33.35 v1(48.9,34.24)
SWDIO: length 51.2
  Top Layer w0.254: H2.2 10.29,13.65 v1(10.29,14.94) ; v1(48.9,32.72) 50.93,32.72 50.96,32.69
  Inner1 w0.254: v1(48.9,32.72) 45.72,29.54 37.97,29.54 34.29,25.86 20.57,25.86 19.43,24.71 19.43,23.95 10.41,14.94 v1(10.29,14.94)
SYN_RX: length 15
  Top Layer w0.203: R44.1 56.95,32.59 60.71,32.59 61.21,33.1 61.21,34.75 61.85,35.38 66.09,35.38 R50.2
SYN_RX_FLIP: length 5.1
  Top Layer w0.203: R51.1 69.6,43 69.98,42.62 69.98,41.88 U25.28
SYN_TX: length 23.7
  Top Layer w0.203: R45.1 56.95,30.05 60.83,30.05 61.85,31.06 61.85,34.58 62.15,34.87 66.42,34.87 68.07,36.53 69.34,36.53 69.98,37.16 69.98,37.8 70.74,38.56 72.29,38.56 72.57,38.83 U25.27
UART0_RX32: length 43.7
  Top Layer w0.203: U5.6 82.16,20.03 80.65,21.54 75.69,21.54 73.53,19.38 55.63,19.38 54.48,20.52 54.48,30.05 53.34,31.19 50.96,31.19
UART0_TX32: length 42.2
  Top Layer w0.203: U5.7 80.89,20.03 80.01,20.9 76.23,20.9 74.07,18.75 55.37,18.75 53.85,20.27 53.85,29.79 52.95,30.69 50.96,30.69
UART1_RX3861/TOF_TX: length 91.3
  Top Layer w0.254: v1(53.47,45.67) 53.47,45.54 57.51,41.5 CN1.18 ; v1(5.08,16.84) 3.56,15.32 H7.2
  Inner1 w0.254: v1(53.47,45.67) 52.58,46.56 5.33,46.56 2.54,43.76 2.54,22.81 5.08,20.27 v1(5.08,16.84)
UART1_TX3861/TOF_RX: length 93.8
  Top Layer w0.254: v1(53.97,47.19) 57.13,44.04 59.19,44.04
  Inner1 w0.254: v1(53.97,47.19) 53.59,47.57 4.95,47.57 1.65,44.27 1.65,22.3 4.32,19.63 4.32,14.68 H7.3
UART_RX3861/UART_TX32: length 23.1
  Top Layer w0.254: U8.16 41.19,26.19 v1(41.53,25.86) ; v1(55.75,21.28) 58.19,23.72 CN1.4
  Inner1 w0.254: v1(55.75,21.28) 55.37,20.9 46.48,20.9 v1(41.53,25.86)
UART_TX3861/UART_RX32: length 22.6
  Top Layer w0.254: CN1.2 57.43,21.18 v1(56.51,20.27) ; U8.17 41.46,22.99 41.15,22.68 v1(41.15,21.28)
  Inner1 w0.254: v1(41.15,21.28) 41.15,20.65 41.91,19.89 56.13,19.89 v1(56.51,20.27)
USB_N32: length 3.4
  Top Layer w0.203: U5.2 80.89,13.42 82.36,11.95 D5.4
USB_N_32: length 9.8
  Top Layer w0.203: USB4.B7 79.91,8.17 79.5,8.59 79.5,9.6 79.77,9.87 82.03,9.87 82.36,9.54 D5.3 82.36,8.27 81.91,7.82 81.3,7.82 80.91,7.44 USB4.A7
USB_P32: length 3.1
  Top Layer w0.203: U5.1 79.62,12.28 80.46,11.44 80.46,11.38
USB_P_32: length 5.5
  Top Layer w0.203: USB4.B6 81.41,5.8 81.15,5.54 80.65,5.54 80.41,5.77 USB4.A6 80.46,6.81 80.46,9.08
VB32: length 13.2
  Top Layer w0.762: D4.2 74.97,11.6 72.9,9.52 69.52,9.52 68.45,8.46 68.45,4.9 69.01,4.34 Q2.2
$1N601: length 5.3
  Top Layer w0.635: L1.1 38.76,12.29 37.92,11.45 37.92,9.35
$1N606: length 7.5
  Top Layer w0.762: 39.19,9.35 39.19,10.05 39.75,10.62 41.91,10.62 42.67,9.86 42.67,9.38 ; R9.1 44.68,9.38 42.67,9.38 ; 42.67,9.38 42.67,9.16
$1N607: length 1.4
  Top Layer w0.508: R6.1 C24.2
$1N610: length 4
  Top Layer w0.254: U2.8 49.19,8.16 49.53,7.82 50.67,7.82 51.14,8.29 U2.5
$1N612: length 1.9
  Top Layer w0.203: 49.19,3.25 49.19,1.89 R7.2
$1N613: length 3.2
  Top Layer w0.203: U2.7 49.84,10.62 C12.2
  Top Layer w0.381: C12.2 49.66,10.8 R8.1
$1N615: length 3.2
  Top Layer w0.254: 51.14,3.25 51.14,4.05 50.8,4.39 50.16,4.39 49.84,4.07 49.84,3.25
$1N1198: length 43.5
  Top Layer w0.254: v1(56.64,37.54) 55.63,37.54 55.12,38.05 55.12,38.93 R10.2
  Inner1 w0.254: 40.39,9.35 40.39,10.11 40.77,10.49 49.66,10.49 57.53,18.36 57.53,36.65 v1(56.64,37.54)
  vias: v1(40.46,9.35)
$1N2665: length 2.7
  Top Layer w0.254: 48.64,21.6 48.46,21.78 U8.31
$1N2666: length 2.7
  Top Layer w0.254: 50.96,33.19 53.57,33.19 C40.2
$1N2670: length 2.2
  Top Layer w0.203: R42.1 43.46,37.87 U8.60
$1N2672: length 2.5
  Top Layer w0.254: U8.28 46.96,21.85 R43.1
$1N2674: length 12.8
  Top Layer w0.203: C42.2 29.17,28.47 CRYSTAL1.1 30.57,30.11 R38.1 31.53,30.78 31.94,31.19 39.46,31.19
$1N2677: length 15
  Top Layer w0.203: U8.5 39.41,31.64 R38.2 30.87,31.64 30.41,31.19 27.94,31.19 27.47,31.66 CRYSTAL1.3 27.47,33.82 C43.1
$1N2678: length 14.7
  Top Layer w0.203: X1.1 28.87,39.34 C45.1 29.45,37.69 34.94,32.19 U8.4
$1N2679: length 12.6
  Top Layer w0.203: X1.2 31.46,39.3 C44.1 31.46,36.44 35.2,32.69 U8.3
$1N3817: length 5.3
  Top Layer w0.158: U3.11 5.17,41.33 5.21,41.37
$1N4291: length 2.7
  Top Layer w0.203: v1(82.55,4.9) 82.41,5.04 USB4.B5
  Bottom Layer w0.203: R41.2 82.55,4.19 v1(82.55,4.9)
$1N4294: length 2.8
  Top Layer w0.203: USB4.A5 79.41,5.2 v1(79.25,5.03)
  Bottom Layer w0.203: v1(79.25,5.03) 79.06,4.84 R5.2
$1N4295: length 12.6
  Top Layer w0.508: USB4.B4A9 83.04,8.19 83.19,8.33 83.19,9.98 82.8,10.36 78.99,10.36 77.6,8.97 F1.2 78.28,7.91 USB4.A4B9
$1N4303: length 16.6
  Bottom Layer w0.203: USB4.15 84.68,2.14 C54.2 81,2.1 R35.2 79.28,2.45 USB4.14
  Bottom Layer w0.254: USB4.12 USB4.14 ; USB4.15 USB4.13
$1N4790: length 9.7
  Top Layer w0.381: U16.3 71.55,17.02 71.25,16.71 71.25,15.7 71.83,15.12 U16.1 73.93,15.12 C18.1 C17.1
  Top Layer w0.635: D4.1 72.29,12.73 U16.1
$1N4991: length 9.5
  Top Layer w0.381: U10.3 36.01,19.45 36.32,19.76 36.32,20.9 35.88,21.35 U10.1 ; C56.1 C55.1
  Top Layer w0.635: U10.3 34.3,19.45 34.11,19.63 C56.1 33.02,19.61 33.02,18.62 32.42,18.02 D6.1
$1N5567: length 6.9
  Top Layer w0.762: 22.87,9.1 22.1,8.33 21.34,8.33 20.96,7.95 USB5.B9 ; 22.87,9.1 22.87,9.08 24,7.95 USB5.A9 ; 22.87,9.1 F3.2
$1N5570: length 2.3
  Top Layer w0.254: USB5.B5 v1(22.98,5.66)
  Bottom Layer w0.254: v1(22.98,5.66) 23.19,5.45 R1.2
$1N5572: length 2.3
  Top Layer w0.254: v1(21.84,5.66) 21.98,5.8 USB5.A5
  Bottom Layer w0.254: v1(21.84,5.66) 21.84,4.87 R32.1
$1N5574: length 16.3
  Bottom Layer w0.254: 18.16,6.48 18.16,2.67 21.57,2.67 C58.2 23.16,2.78 23.18,2.8 26.68,2.8 26.8,2.67 USB5.4
$1N5749: length 10.9
  Top Layer w0.254: 50.96,28.19 52.53,28.19 v1(53.09,27.64)
  Inner1 w0.254: v1(55.37,31.95) 55.37,31.45 55.5,31.32 56.64,31.32 56.9,31.06 56.9,29.16 55.37,27.64 v1(53.09,27.64)
$1N5781: length 4.7
  Top Layer w0.254: v1(53.21,29.29) 52.62,28.69 50.96,28.69
  Inner1 w0.254: v1(53.21,29.29) 55.25,29.29 55.37,29.41
  vias: v1(55.45,29.41)
$1N9722: length 2.1
  Top Layer w0.254: C59.2 45.74,44.08 46.31,43.51 47.33,43.51 47.43,43.41
$1N9831: length 6.1
  Top Layer w0.254: C60.2 44.32,42.66 44.32,44.53 44.58,44.78 47.61,44.78 47.86,44.53 47.86,44.5
$2N3356: length 11.6
  Top Layer w0.203: R48.2 81.66,31.45 v1(81.53,31.57) ; v1(74.8,34.62) 74.52,34.33 U25.5
  Inner2 w0.203: v1(81.53,31.57) 81.53,33.6 80.52,34.62 v1(74.8,34.62)
$2N3459: length 13.2
  Top Layer w0.203: U25.24 74.52,38.97 75.18,38.3 76.71,38.3 77.47,37.54 83.29,37.54 CRYSTAL2.1 84.1,37.08 C62.2
$2N3469: length 17
  Top Layer w0.203: U25.25 73.87,38.86 74.93,37.8 76.45,37.8 77.22,37.03 82.3,37.03 82.8,36.53 82.8,36.14 83.19,35.76 84.71,35.76 85.62,34.85 CRYSTAL2.3 85.62,33.15 C63.1
$2N4024: length 3.8
  Top Layer w0.203: Q3.3 67.18,39.82 R52.2 R51.2
$2N4028: length 1.5
  Top Layer w0.203: R50.1 69.23,37.66 Q3.1

## Copper pours and planes (outline as drawn; the poured copper is in the pictures)
3.3V on Top Layer: 33.66,23.19 37.72,23.19 37.72,22.43 33.66,22.43
5V on Top Layer: 32.64,12.92 36.96,12.92 36.96,5.94 32.64,5.94
5V on Top Layer: 68.2,29.44 71.63,29.44 71.63,28.65 68.2,28.65
5V on Inner2: 63.5,44.53 64.39,44.53 64.39,36.78 63.5,36.78
GND on Top Layer: -3.17,52.4 93.6,52.4 93.6,-5.38 -3.17,-5.38
GND on Bottom Layer: -4.83,54.56 97.54,54.56 97.54,-10.08 -4.83,-10.08
GND on Inner1: -7.49,51.13 96.77,51.13 96.77,-1.96 -7.49,-1.96
VBUS_BAT on Top Layer: 34.83,5.16 37,5.16 37,0.89 34.83,0.89
BAT on Bottom Layer: 57.91,10.74 61.72,10.74 61.72,4.14 57.91,4.14

Small or netless copper shapes (teardrops, artwork), in the pictures only: 345 on Top Layer, 28 on Bottom Layer, 48 on Inner1, 23 on Inner2

## Text on the board
Bottom Silkscreen Layer: BAT | GND
Top Silkscreen Layer: GND | SWDIO | SWCLK | 3.3V | 2024共创芯未来
